# EAGLE design miavita (EAGLE 5.12)
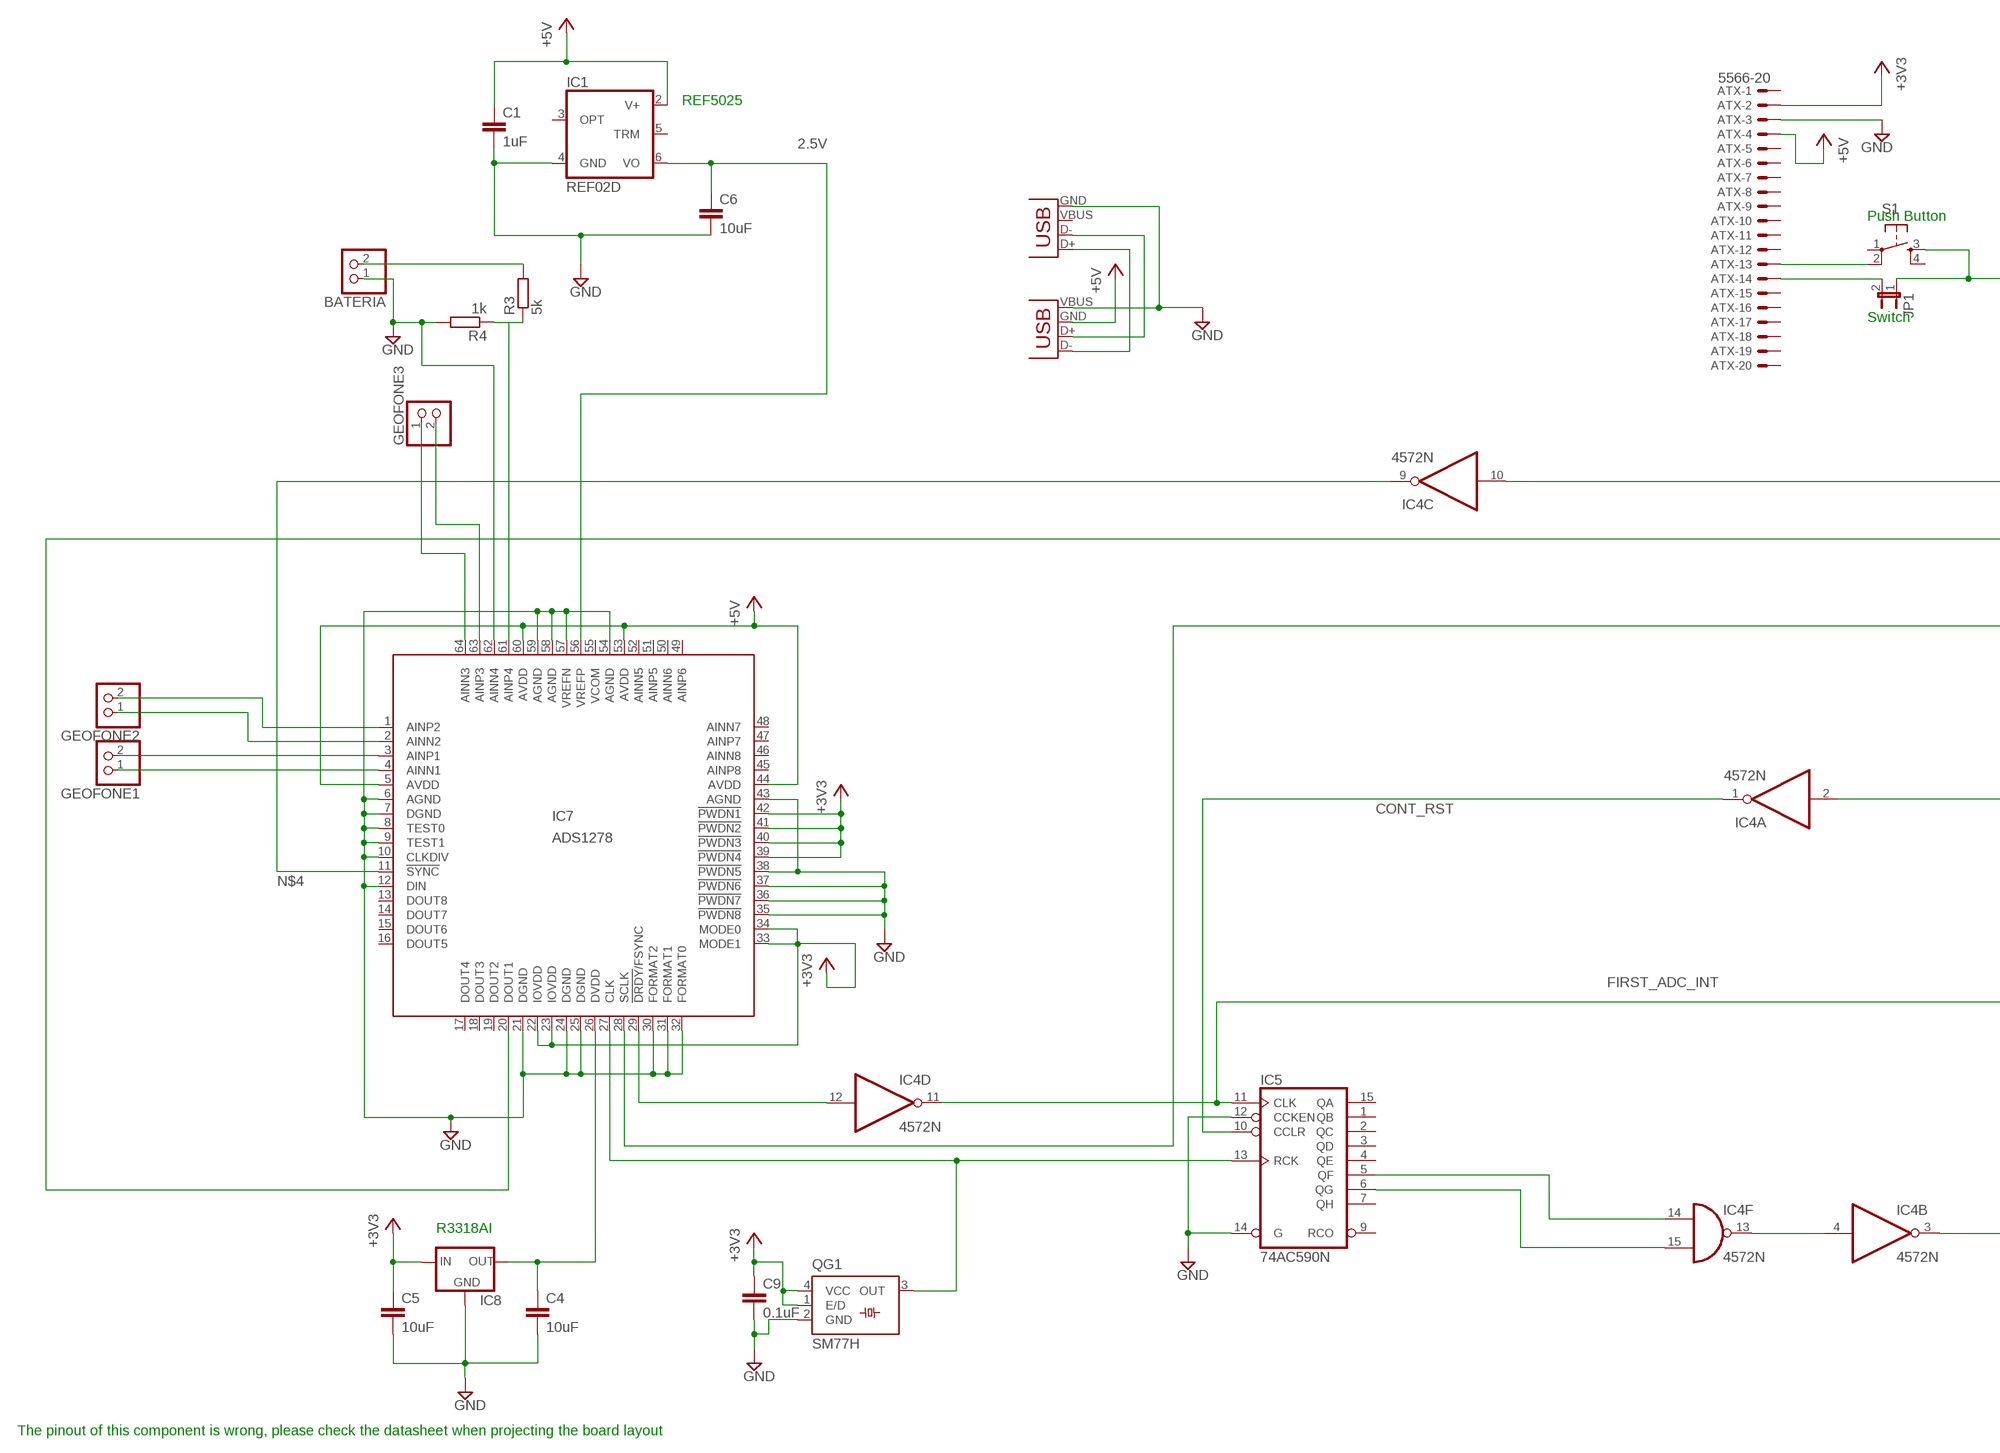
[diagram p0: schematic, sheet 1, part 1 of 2]
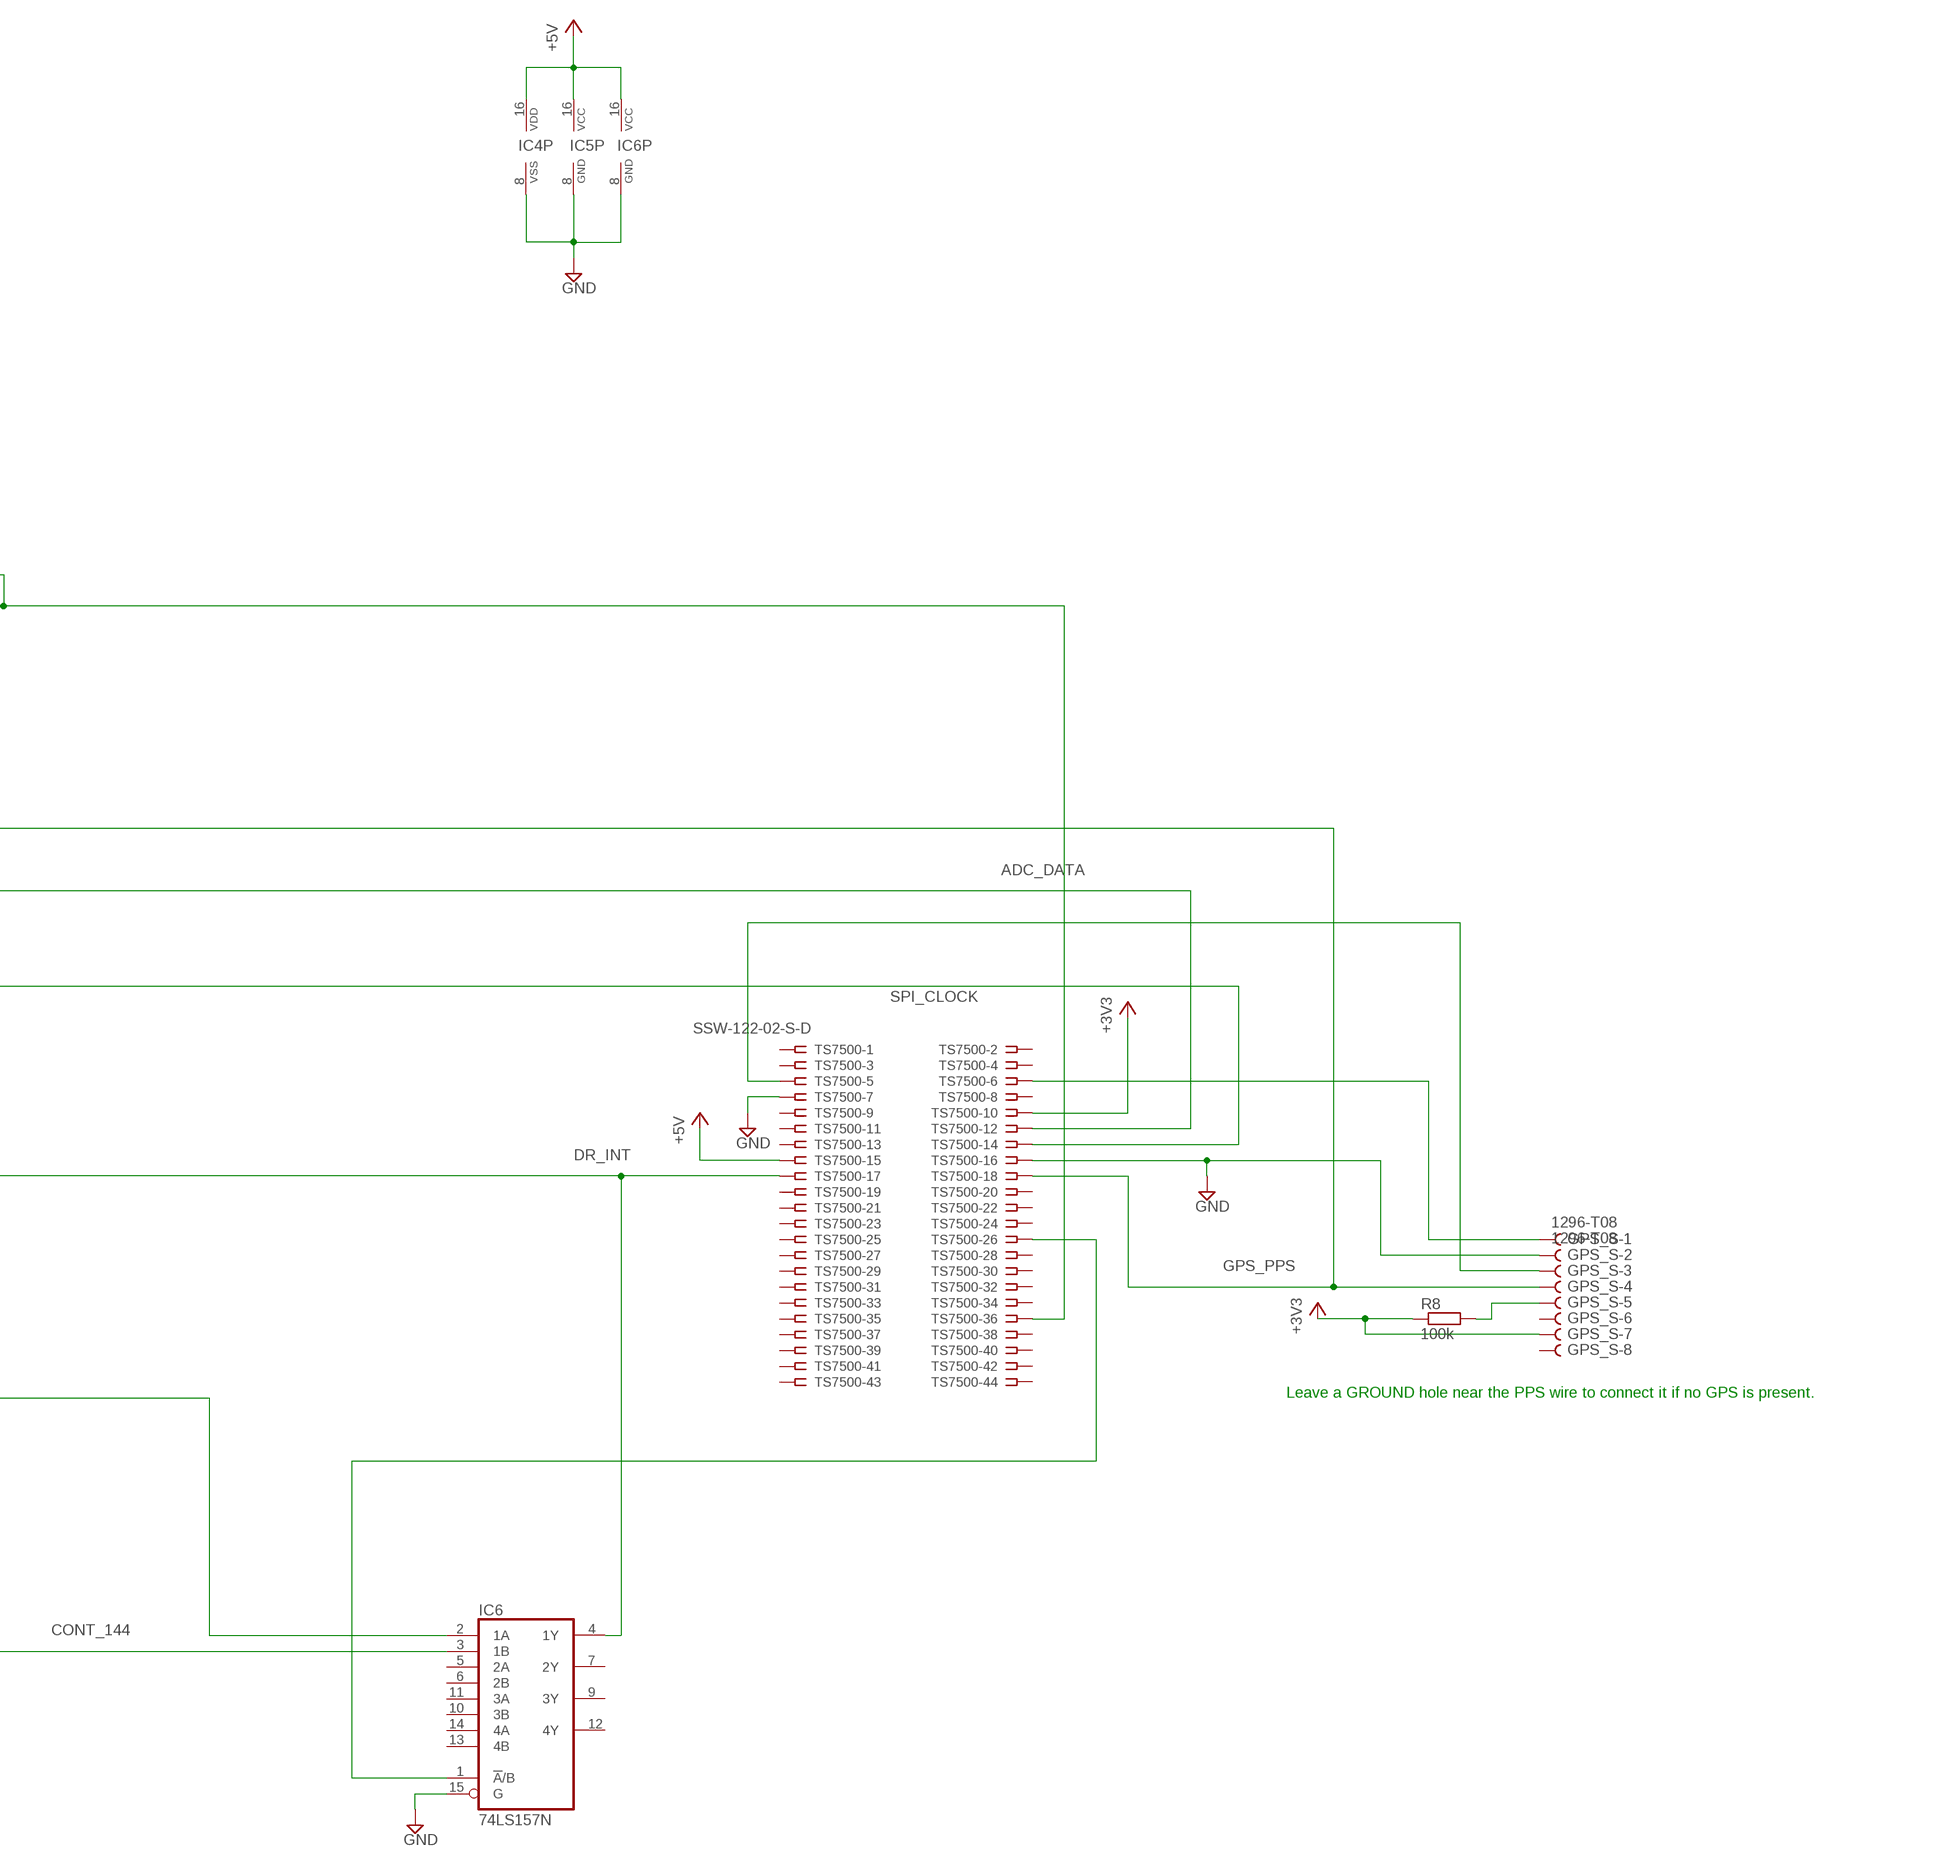
[diagram p1: schematic, sheet 1, part 2 of 2]

## Parts
ATX  5566-20  [5566-20]
BATERIA  PINHD-1X2  [1X02]
C1  1uF  C5/2.5  [C5B2.5]
C4  10uF  C5/2.5  [C5B2.5]
C5  10uF  C5/2.5  [C5B2.5]
C6  10uF  C5/2.5  [C5B2.5]
C9  0.1uF  C5/2.5  [C5B2.5]
GEOFONE1  PINHD-1X2  [1X02]
GEOFONE2  PINHD-1X2  [1X02]
GEOFONE3  PINHD-1X2  [1X02]
GPS_S  1296-T08  [1296-08]
IC1  REF02D  [SO08]
IC4  4572N  [DIL16]
IC5  74AC590N  [DIL16]
IC6  74LS157N  [DIL16]
IC7  ADS1278  [HTQFP-64-PAP]
IC8  XC63FPM  [SOT23]
JP1  JP1E  [JP1]
QG1  SM77H  [SM77H]
R3  5k  R-EU_0204/5  [0204/5]
R4  1k  R-EU_0204/5  [0204/5]
R8  100k  R-EU_0204/5  [0204/5]
S1  TAC_SWITCHPTH  [TACTILE-PTH]
TS7500  SSW-122-02-S-D  [SSW-122-02-S-D]
USBA  USB-A-H  [USB-A-H]
USBB  USBPTH  [USB-B-PTH]

## Nets
2.5V: C6.1 IC1.6(VO) IC7.56(VREFP)
+1V8: C4.1 IC7.26(DVDD) IC8.2(OUT)
+3V3: ATX.2 C5.1 C9.1 GPS_S.7 IC7.22(IOVDD) IC7.23(IOVDD) IC7.33(MODE1) IC7.34(MODE0) IC7.39(!PWDN4) IC7.40(!PWDN3) IC7.41(!PWDN2) IC7.42(!PWDN1) IC8.3(IN) QG1.1(E/D) QG1.4(VCC) R8.1 TS7500.10
+5V: ATX.4 C1.1 IC1.2(V+) IC4.16(P:VDD) IC5.16(VCC) IC6.16(VCC) IC7.5(AVDD) IC7.44(AVDD) IC7.53(AVDD) IC7.60(AVDD) TS7500.15 USBA.GND(VBUS)
ADC_DATA: IC7.20(DOUT1) TS7500.12
CONT_144: IC4.3(B:O) IC6.3(1B)
CONT_RST: IC4.1(A:O) IC5.10(CCLR)
DR_INT: IC4.2(A:I) IC6.4(1Y) TS7500.17
FIRST_ADC_INT: IC4.11(D:O) IC5.11(CLK) IC6.2(1A)
GND: ATX.3 BATERIA.1 C1.2 C4.2 C5.2 C6.2 C9.2 GPS_S.2 IC1.4(GND) IC4.8(P:VSS) IC5.8(GND) IC5.12(CCKEN) IC5.14(G) IC6.8(GND) IC6.15(G) IC7.6(AGND) IC7.7(DGND) IC7.8(TEST0) IC7.9(TEST1) IC7.10(CLKDIV) IC7.12(DIN) IC7.21(DGND) IC7.24(DGND) IC7.25(DGND) IC7.30(FORMAT2) IC7.31(FORMAT1) IC7.32(FORMAT0) IC7.35(!PWDN8) IC7.36(!PWDN7) IC7.37(!PWDN6) IC7.38(!PWDN5) IC7.43(AGND) IC7.54(AGND) IC7.57(VREFN) IC7.58(AGND) IC7.59(AGND) IC7.62(AINN4) IC8.1(GND) QG1.2(GND) R4.2 TS7500.7 TS7500.16 USBA.VBUS(GND) USBB.GND
GPS_PPS: GPS_S.4 IC4.10(C:I) TS7500.18
N$1: IC6.1(!A!/B) TS7500.26
N$2: IC4.15(F:I1) IC5.6(QG)
N$3: IC4.14(F:I0) IC5.5(QF)
N$4: IC4.9(C:O) IC7.11(!SYNC)
N$5: IC4.4(B:I) IC4.13(F:O)
N$6: JP1.1 S1.3 TS7500.36
N$7: IC4.12(D:I) IC7.29(!DRDY!/FSYNC)
N$8: GEOFONE1.2 IC7.3(AINP1)
N$9: ATX.13 S1.2
N$10: GEOFONE1.1 IC7.4(AINN1)
N$11: GEOFONE2.2 IC7.1(AINP2)
N$12: IC7.61(AINP4) R3.1 R4.1
N$13: USBA.D+(D-) USBB.D-
N$14: GEOFONE3.2 IC7.63(AINP3)
N$15: GEOFONE3.1 IC7.64(AINN3)
N$17: IC5.13(RCK) IC7.27(CLK) QG1.3(OUT)
N$18: USBA.D-(D+) USBB.D+
N$19: BATERIA.2 R3.2
N$23: ATX.14 JP1.2
N$42: GPS_S.1 TS7500.6
N$43: GPS_S.3 TS7500.5
N$44: GPS_S.5 R8.2
N$46: GEOFONE2.1 IC7.2(AINN2)
SPI_CLOCK: IC7.28(SCLK) TS7500.14
Unconnected: ATX.1 ATX.5 ATX.6 ATX.7 ATX.8 ATX.9 ATX.10 ATX.11 ATX.12 ATX.15 ATX.16 ATX.17 ATX.18 ATX.19 ATX.20 GPS_S.6 GPS_S.8 IC1.3(OPT) IC1.5(TRM) IC4.5(E:O) IC4.6(E:I0) IC4.7(E:I1) IC5.1(QB) IC5.2(QC) IC5.3(QD) IC5.4(QE) IC5.7(QH) IC5.9(RCO) IC5.15(QA) IC6.5(2A) IC6.6(2B) IC6.7(2Y) IC6.9(3Y) IC6.10(3B) IC6.11(3A) IC6.12(4Y) IC6.13(4B) IC6.14(4A) IC7.13(DOUT8) IC7.14(DOUT7) IC7.15(DOUT6) IC7.16(DOUT5) IC7.17(DOUT4) IC7.18(DOUT3) IC7.19(DOUT2) IC7.45(AINP8) IC7.46(AINN8) IC7.47(AINP7) IC7.48(AINN7) IC7.49(AINP6) IC7.50(AINN6) IC7.51(AINP5) IC7.52(AINN5) IC7.55(VCOM) IC7.EXP1(EXP) IC7.EXP2(EXP) IC7.EXP3(EXP) IC7.EXP4(EXP) IC7.EXP5(EXP) IC7.EXP6(EXP) IC7.EXP7(EXP) IC7.EXP8(EXP) IC7.EXP9(EXP) IC7.EXP10(EXP) IC7.EXP11(EXP) IC7.EXP12(EXP) IC7.EXP13(EXP) IC7.EXP14(EXP) IC7.EXP15(EXP) IC7.EXP16(EXP) IC7.EXP17(EXP) IC7.EXP18(EXP) IC7.EXP19(EXP) IC7.EXP20(EXP) IC7.EXP21(EXP) IC7.EXP22(EXP) IC7.EXP23(EXP) IC7.EXP24(EXP) IC7.EXP25(EXP) S1.1 S1.4 TS7500.1 TS7500.2 TS7500.3 TS7500.4 TS7500.8 TS7500.9 TS7500.11 TS7500.13 TS7500.19 TS7500.20 TS7500.21 TS7500.22 TS7500.23 TS7500.24 TS7500.25 TS7500.27 TS7500.28 TS7500.29 TS7500.30 TS7500.31 TS7500.32 TS7500.33 TS7500.34 TS7500.35 TS7500.37 TS7500.38 TS7500.39 TS7500.40 TS7500.41 TS7500.42 TS7500.43 TS7500.44 USBB.VBUS

## Notes on the sheet
- REF5025
- Push Button
- Switch
- Leave a GROUND hole near the PPS wire to connect it if no GPS is present.
- R3318AI
- The pinout of this component is wrong, please check the datasheet when projecting the board layout

## Library data of the parts
ATX = con-molex:5566-20: Mini FIT connector 20 pol ATX PC-Motherboard Power connector Source: http://www.molex.com; OC_FARNELL: unknown; OC_NEWARK: unknown
BATERIA GEOFONE1-GEOFONE3 = pinhead:PINHD-1X2: PIN HEADER
C1 C4-C6 C9 = capacitor-wima:C: CAPACITOR naming: grid - package width
GPS_S = con-leotronics:1296-T08: 1.27mm SINGLE ROW FEMALE SOCKET Source: http://www.leotronics.co.uk/Conexcon/Data%20Sheets/sec.%20A/1296ing.pdf; OC_FARNELL: unknown; OC_NEWARK: unknown
IC1 = linear:REF02: VOLTAGE REFERENCE
IC4 = 45xx:4572: INVERTER/OR/NOR (MC14572BCP)
IC5 = 74xx-eu:74*590: 8-bit binary COUNTER, output register
IC6 = 74xx-eu:74*157: Quadruple 2-line to 1-line data SELECTOR/MULTIPLEXER
IC7 = texas:ADS1278: Quad/Octal, Simultaneous Sampling, 24-Bit Analog-to-Digital Converters ADS1274 / ADS1278 Auto generated by make-symbol-device-package-bsdl.ulp Rev. 29 Source: http://focus.ti.com/lit/ds/symlink/ads1274.pdf; MPN: ADS1278IPAPT; OC_FARNELL: 1603419; OC_NEWARK: 50M8811
IC8 = v-reg:XC63FP: Positiv Voltage Regulators www.torex.co.jp/english/product/pro02/pdf/0201_xc62fp.pdf
JP1 = jumper:JP1E: JUMPER
QG1 = crystal:SM77H: 3.3V CMOS Clock Oscillator Source: www.pletronics.com .. sm77h%203.3v.pdf; OC_FARNELL: unknown; OC_NEWARK: unknown
R3 R4 = rcl:R-EU_: RESISTOR, European symbol
R8 = resistor:R-EU_: RESISTOR, European symbol
S1 = SparkFun:TAC_SWITCH: Momentary Switch Button commonly used for reset or general input. Spark Fun Electronics SKU : COM-00097
TS7500 = con-samtec:SSW-122-02-S-D: THROUGH-HOLE .025" SQ POST SOCKET Source: Samtec SSW.pdf; MPN: SSW-122-02-S-D; OC_FARNELL: unknown; OC_NEWARK: 11P9673
USBA USBB = SparkFun:USB: USB Connectors USB-B-PTH is fully proven SKU : PRT-00139 USB-miniB is fully proven SKU : PRT-00587 USB-A-PCB is untested. USB-A-H is throughly reviewed, but untested. Spark Fun Electronics SKU : PRT-00437 USB-B-SMT is throughly reviewed, but untested. Needs silkscreen touching up. USB-A-S has not been used/tested USB-MB-H has not been used/tested

## Board
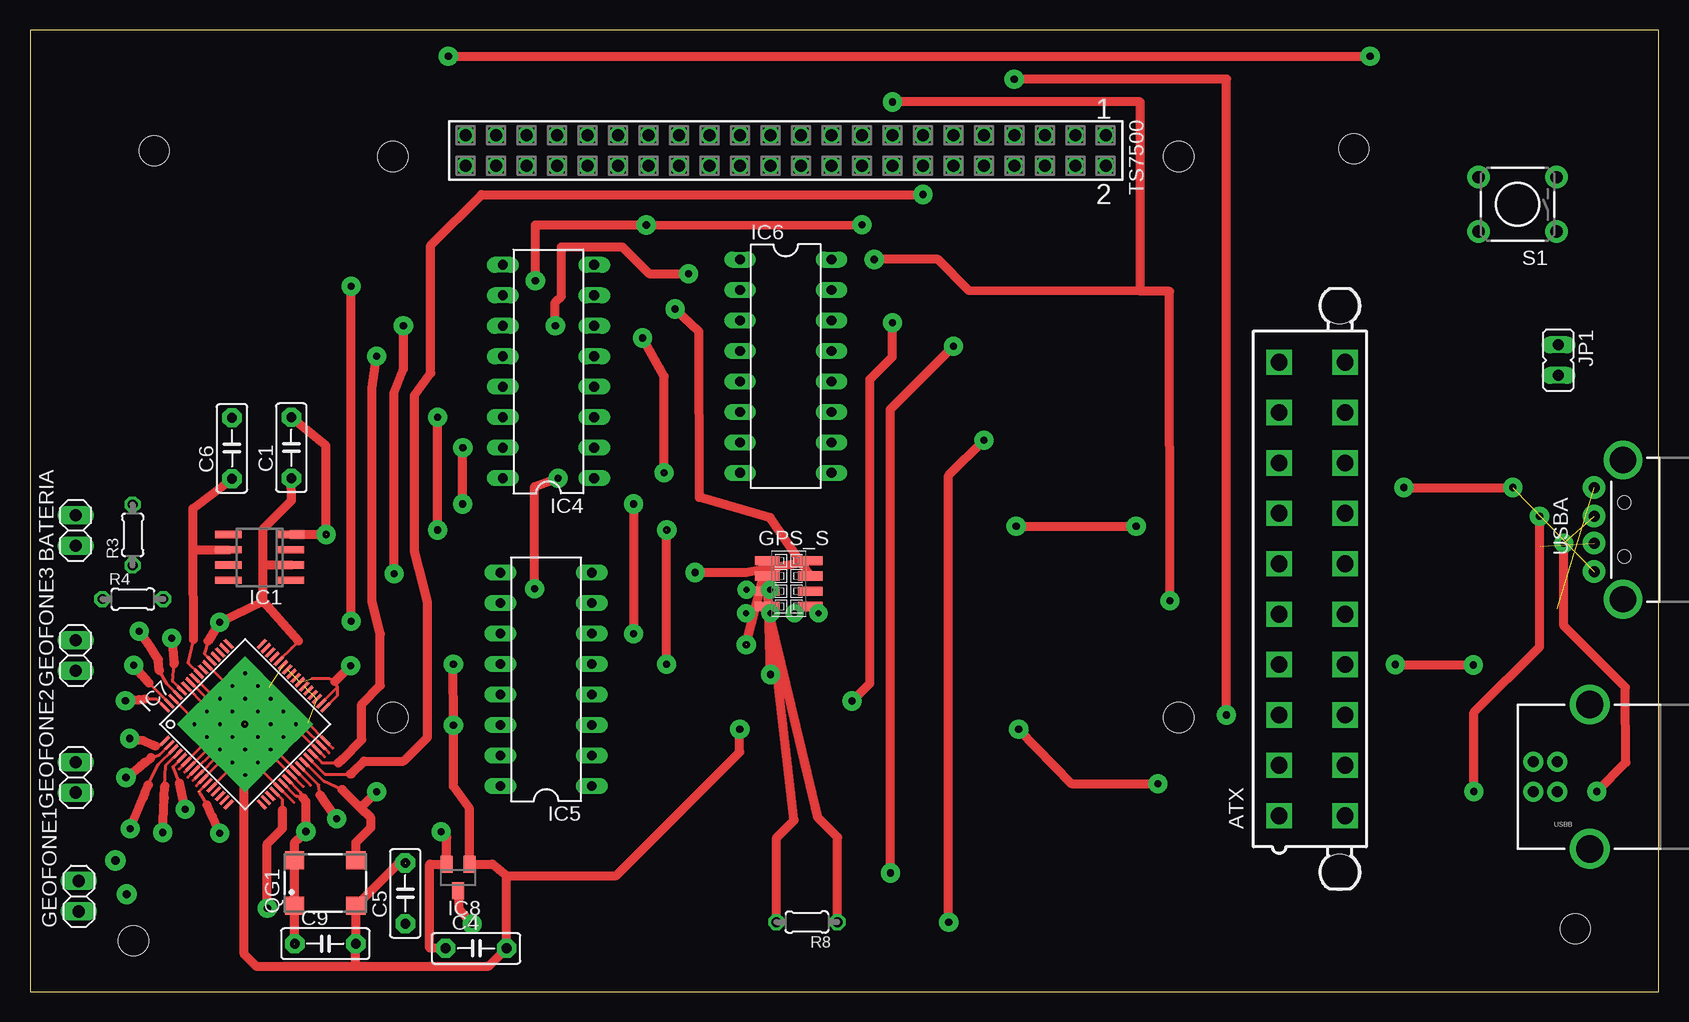
[diagram p2: board, top side]
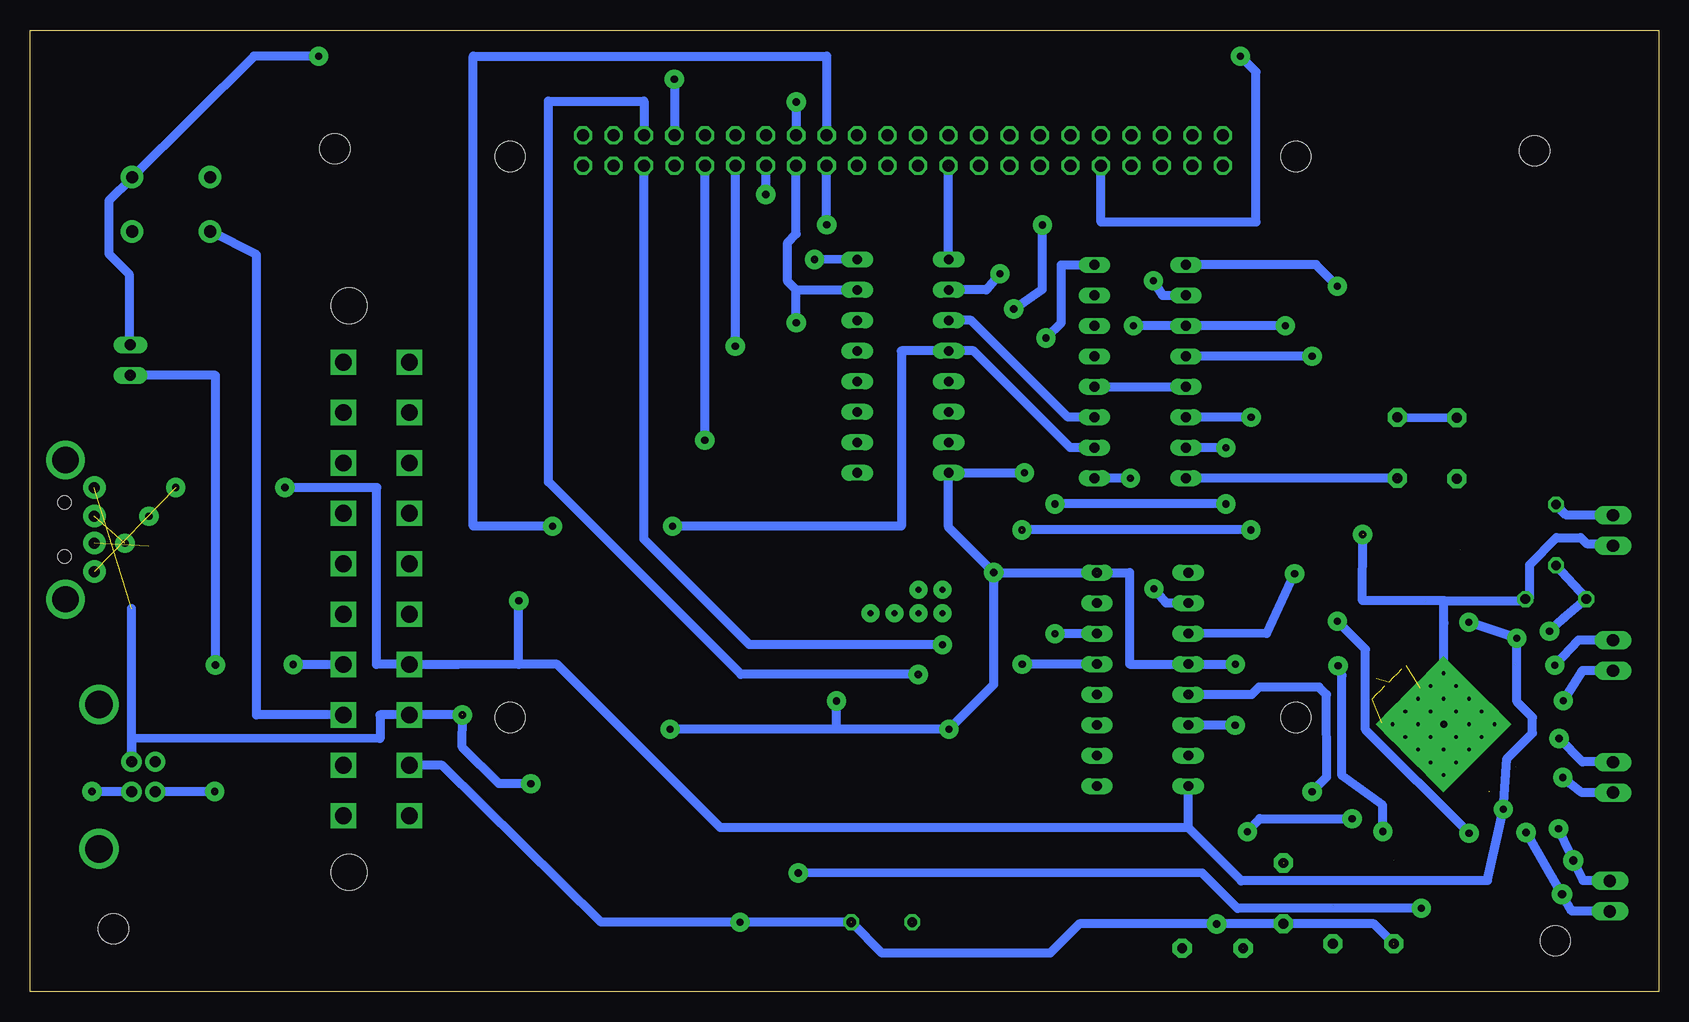
[diagram p3: board, bottom side, seen from below]

Size 135.76 x 80.13 mm. Coordinates in mm from the lower left corner, seen from the top.
Outline: 0,0 135.76,0 135.76,80.13 0,80.13 0,0
Copper layers (1*16): Top 0.035mm / dielectric 1.5mm / Bottom 0.035mm
Design rules "default *": minimum track width 0.75mm, minimum drill 0.5mm, track to track 0.4mm, track to pad 0.4mm, pad to pad 0.4mm, via to via 0.4mm, smd to smd 8mil, copper to edge 40mil, drill to drill 8mil, minimum pad ring 10mil, minimum via ring 0.5mm, stop-mask expansion 0.5mm, vias tented up to drill 0mil, thermal gap 10mil
Holes 2.5 mm at 30.25,69.59 95.75,69.59 95.75,22.84 30.25,22.84 8.62,4.24 128.8,5.24 110.35,70.24 10.35,70.06
tKeepout: area 0,26 to 0,26

### Footprints (pad centres in the part's own frame; a part is rotated, then mirrored left to right if it is on the bottom)
5566-20 = drill 1.4 square: 1 18.9,-2.75; 2 14.7,-2.75; 3 10.5,-2.75; 4 6.3,-2.75; 5 2.1,-2.75; 6 -2.1,-2.75; 7 -6.3,-2.75; 8 -10.5,-2.75; 9 -14.7,-2.75; 10 -18.9,-2.75; 11 18.9,2.75; 12 14.7,2.75; 13 10.5,2.75; 14 6.3,2.75; 15 2.1,2.75; 16 -2.1,2.75; 17 -6.3,2.75; 18 -10.5,2.75; 19 -14.7,2.75; 20 -18.9,2.75 | hole 3: 23.6,2.29; -23.6,2.29
1X02 = drill 1.016 long: 1 -1.27,0; 2 1.27,0
C5B2.5 = drill 0.813 pad 1.6 octagon: 1 -2.54,0; 2 2.54,0
1296-08 = smd 0.76 x 2.05: 1 -1.905,-1.78; 2 -1.905,1.78; 3 -0.635,-1.78; 4 -0.635,1.78; 5 0.635,-1.78; 6 0.635,1.78; 7 1.905,-1.78; 8 1.905,1.78
SO08 = smd 0.6 x 2.2: 1 -1.905,-2.6; 2 -0.635,-2.6; 3 0.635,-2.6; 4 1.905,-2.6; 5 1.905,2.6; 6 0.635,2.6; 7 -0.635,2.6; 8 -1.905,2.6
DIL16 = drill 0.813 long: 1 -8.89,-3.81; 2 -6.35,-3.81; 3 -3.81,-3.81; 4 -1.27,-3.81; 5 1.27,-3.81; 6 3.81,-3.81; 7 6.35,-3.81; 8 8.89,-3.81; 9 8.89,3.81; 10 6.35,3.81; 11 3.81,3.81; 12 1.27,3.81; 13 -1.27,3.81; 14 -3.81,3.81; 15 -6.35,3.81; 16 -8.89,3.81
HTQFP-64-PAP = smd 1 x 0.25: 1 -5.7,3.75; 2 -5.7,3.25; 3 -5.7,2.75; 4 -5.7,2.25; 5 -5.7,1.75; 6 -5.7,1.25; 7 -5.7,0.75; 8 -5.7,0.25; 9 -5.7,-0.25; 10 -5.7,-0.75; 11 -5.7,-1.25; 12 -5.7,-1.75; 13 -5.7,-2.25; 14 -5.7,-2.75; 15 -5.7,-3.25; 16 -5.7,-3.75; 33 5.7,-3.75; 34 5.7,-3.25; 35 5.7,-2.75; 36 5.7,-2.25; 37 5.7,-1.75; 38 5.7,-1.25; 39 5.7,-0.75; 40 5.7,-0.25; 41 5.7,0.25; 42 5.7,0.75; 43 5.7,1.25; 44 5.7,1.75; 45 5.7,2.25; 46 5.7,2.75; 47 5.7,3.25; 48 5.7,3.75 | smd 0.25 x 1: 17 -3.75,-5.7; 18 -3.25,-5.7; 19 -2.75,-5.7; 20 -2.25,-5.7; 21 -1.75,-5.7; 22 -1.25,-5.7; 23 -0.75,-5.7; 24 -0.25,-5.7; 25 0.25,-5.7; 26 0.75,-5.7; 27 1.25,-5.7; 28 1.75,-5.7; 29 2.25,-5.7; 30 2.75,-5.7; 31 3.25,-5.7; 32 3.75,-5.7; 49 3.75,5.7; 50 3.25,5.7; 51 2.75,5.7; 52 2.25,5.7; 53 1.75,5.7; 54 1.25,5.7; 55 0.75,5.7; 56 0.25,5.7; 57 -0.25,5.7; 58 -0.75,5.7; 59 -1.25,5.7; 60 -1.75,5.7; 61 -2.25,5.7; 62 -2.75,5.7; 63 -3.25,5.7; 64 -3.75,5.7 | drill 0.3 pad 2 square: EXP1 -3,3; EXP2 -1.5,3; EXP3 0,3; EXP4 1.5,3; EXP5 3,3; EXP6 -3,1.5; EXP7 -1.5,1.5; EXP8 0,1.5; EXP9 1.5,1.5; EXP10 3,1.5; EXP11 -3,0; EXP12 -1.5,0; EXP13 0,0; EXP14 1.5,0; EXP15 3,0; EXP16 -3,-1.5; EXP17 -1.5,-1.5; EXP18 0,-1.5; EXP19 1.5,-1.5; EXP20 3,-1.5; EXP21 -3,-3; EXP22 -1.5,-3; EXP23 0,-3; EXP24 1.5,-3; EXP25 3,-3
SOT23 = smd 1 x 1.4: 1 -0.95,-1.1; 2 0.95,-1.1; 3 0,1.1
JP1 = drill 0.914 long: 1 0,-1.27; 2 0,1.27
SM77H = smd 1.6 x 1.5: 1 -2.55,-1.9; 2 2.55,-1.9; 3 2.55,1.9; 4 -2.55,1.9
0204/5 = drill 0.813 octagon: 1 -2.54,0; 2 2.54,0
TACTILE-PTH = drill 1.016 pad 1.88 round: 1 -3.251,2.261; 2 3.251,2.261; 3 -3.251,-2.261; 4 3.251,-2.261
SSW-122-02-S-D = drill 1 pad 1.5 octagon: 1 -26.67,-1.27; 2 -26.67,1.27; 3 -24.13,-1.27; 4 -24.13,1.27; 5 -21.59,-1.27; 6 -21.59,1.27; 7 -19.05,-1.27; 8 -19.05,1.27; 9 -16.51,-1.27; 10 -16.51,1.27; 11 -13.97,-1.27; 12 -13.97,1.27; 13 -11.43,-1.27; 14 -11.43,1.27; 15 -8.89,-1.27; 16 -8.89,1.27; 17 -6.35,-1.27; 18 -6.35,1.27; 19 -3.81,-1.27; 20 -3.81,1.27; 21 -1.27,-1.27; 22 -1.27,1.27; 23 1.27,-1.27; 24 1.27,1.27; 25 3.81,-1.27; 26 3.81,1.27; 27 6.35,-1.27; 28 6.35,1.27; 29 8.89,-1.27; 30 8.89,1.27; 31 11.43,-1.27; 32 11.43,1.27; 33 13.97,-1.27; 34 13.97,1.27; 35 16.51,-1.27; 36 16.51,1.27; 37 19.05,-1.27; 38 19.05,1.27; 39 21.59,-1.27; 40 21.59,1.27; 41 24.13,-1.27; 42 24.13,1.27; 43 26.67,-1.27; 44 26.67,1.27
USB-A-H = drill 0.914 pad 1.88 round: D+ 2.4,1.127; D- 2.4,-1.127; GND 2.4,3.5; VBUS 2.4,-3.5 | drill 2.2 round: GND2 0,-5.8; GND3 0,5.8 | hole 1.1: -0.1,2.25; -0.1,-2.25
USB-B-PTH = drill 0.914 pad 1.676 round: D+ 0,1.25; D- 1.981,1.25; GND 0,-1.25; VBUS 1.981,-1.25 | drill 2.286 round: S1 -2.718,-6.02; S2 -2.718,6.02

### Placement (x,y rotation side)
ATX  106.88,33.55 270 top
BATERIA  3.81,38.43 90 top
C1  21.79,45.33 90 top
C4  37.18,3.6 0 top
C5  31.29,8.18 90 top
C6  16.84,45.27 90 top
C9  24.62,4 0 top
GEOFONE1  4.06,7.95 90 top
GEOFONE2  3.81,17.85 90 top
GEOFONE3  3.81,28.01 90 top
GPS_S  63.25,34 270 top
IC1  19.15,36.19 90 top
IC4  43.22,51.67 90 top
IC5  43.02,26.02 90 top
IC6  63,52.12 270 top
IC7  17.94,22.28 45 top
IC8  35.69,9.51 180 top
JP1  127.4,52.63 180 top
QG1  24.62,9.05 0 top
R3  8.56,38.05 90 top
R4  8.57,32.71 0 top
R8  64.77,5.79 180 top
S1  124,65.61 180 top
TS7500  63,70.09 180 top
USBA  132.79,38.5 180 top
USBB  127.3,17.92 180 top

### Tracks (layer width: path | path; a pad name or v marks a point on that pad's centre or on a via)
2.5V  (1 unrouted)
  Top 0.1: IC1.6 16.5,37.09
  Top 0.25: IC7.56 13.2,27.37 13.62,29.34
  Top 0.75: 13.62,29.34 13.6,36.64 | 13.6,36.64 13.6,36.81 IC1.6 | C6.1 13.6,40.26 13.6,36.64
+1V8  (via drill 0.6)  (1 unrouted)
  Top 0.25: IC7.26 24.07,17.21 24.18,16.39
  Top 0.75: 24.18,16.39 24.65,15.69 v25.55,14.41 | 34.64,3.62 33.33,3.62 33.33,10.61 IC8.2 34.74,12.85 v34.27,13.31
  Bottom 0.75: v34.27,13.31 33.25,14.41 v25.55,14.41
+3V3  (via drill 0.5, 0.6)  (8 unrouted)
  Top 0.1: 22.75,16.11 22.5,16.09
  Top 0.25: 22.57,16.59 IC7.23 | 22.57,16.59 22.75,16.11 22.23,16.27 22.16,16.29 IC7.22 | 22.57,16.59 22.73,16.16 | 23.52,26.09 24.93,26.09 25.4,25.84 | 25.4,25.84 25.66,26.09 | IC7.33 25.6,24.64 25.6,25.35 | 25.6,25.35 IC7.34 | 25.4,25.84 25.6,25.35
  Top 0.75: 22.75,16.11 22.77,16.11 23,15.84 v23,13.34 22.07,12.46 QG1.4 QG1.1 22.07,3.96 | IC8.3 35.75,8.37 35.75,6.87 v36.85,5.64 | v26.73,27.16 25.4,25.84 | GPS_S.7 65.71,14.47 67.32,12.86 R8.1 | v79.51,45.94 76.58,43.01 v76.58,5.78
  Bottom 0.75: C9.1 23.73,5.64 C5.1 v36.85,5.64 48.29,5.64 48.3,5.64 50.73,3.21 64.73,3.21 R8.1 v76.58,5.78 88.15,5.78 101.39,18.86 ATX.2 | v23,13.34 23,15.51 26.39,18 26.39,26.33 v26.73,27.16 | v79.51,45.94 v79.51,68.79 TS7500.10
+5V  (via drill 0.6)  (6 unrouted)
  Top 0.25: IC7.60 11.89,25.86 12,27.29 | IC7.44 21.8,28.62 22.38,29.2 | IC7.5 11.93,18.74 | 12.47,17.36 11.93,18.74 | IC7.53 14.53,28.17 14.85,29.21
  Top 0.75: C1.1 21.8,40.94 19.45,38.56 19.45,35.55 | v12.95,15.19 12.47,17.36 | v11.82,29.44 12,27.29 | 14.85,29.21 v15.82,30.79 19.45,32.54 22.38,29.2 | 19.45,35.55 IC1.2 | 19.45,32.54 19.45,35.55 | v70.38,61.01 75.69,61.01 78.29,58.41 92.55,58.37 | v95.02,32.57 94.98,58.36 92.55,58.37 | v71.89,74.14 92.55,74.14 92.55,58.37 | v114.51,42 v123.61,42
  Bottom 0.75: C1.1 IC4.16 | 39.21,13.66 34.79,9.22 14.27,9.24 12.96,15.15 | 12.96,15.15 v12.95,15.19 | 39.21,13.66 39.9,13.66 78.22,13.66 91.82,27.26 95.02,27.26 | 39.21,13.66 39.21,13.65 | 39.21,13.66 IC5.16 | 12.96,15.15 12.65,19.41 10.53,21.53 10.53,22.86 11.82,24.16 v11.82,29.44 v15.82,30.79 | IC6.16 v70.39,61.02 | 95.02,27.26 100.08,27.25 ATX.4 104.15,27.27 106.87,27.27 106.85,42 v114.51,42 | 95.02,27.26 v95.02,32.57 | v71.89,74.14 TS7500.15
ADC_DATA  (via drill 0.6)
  Top 0.25: IC7.20 21.05,15.99 21.05,15.14
  Top 0.75: 21.05,15.14 21.05,13.6 19.79,12.34 v19.79,6.94 | v76.97,53.77 71.72,48.52 v71.72,9.89
  Bottom 0.75: v19.79,6.94 35.11,6.94 38.05,9.88 v71.72,9.89 | v76.97,53.77 TS7500.12
CONT_144
  Bottom 0.75: IC4.3 49.24,47.86 57.31,55.93 IC6.3
CONT_RST  (via drill 0.6)  (2 unrouted)
  Top 0.75: v42.07,33.57 42.07,42.09 v44.02,42.79
  Bottom 0.75: v44.03,42.78 IC4.1 | IC5.10 41.04,32.37 v42.07,33.57
DR_INT  (via drill 0.6)
  Top 0.75: v82.21,38.78 v92.21,38.79
  Bottom 0.75: IC4.2 49.05,45.32 57.12,53.39 IC6.4 63.12,53.39 63.12,38.78 v82.21,38.78 | v92.21,38.79 98.81,38.79 98.81,77.95 69.35,77.95 TS7500.17
FIRST_ADC_INT  (via drill 0.6)
  Top 0.75: v31.13,55.49 31.13,51.9 30.35,49.89 v30.35,34.83 | v43.79,55.48 43.78,57.44 44.3,57.96 44.3,62.06 49.37,62.06 51.61,59.82 v54.9,59.82
  Bottom 0.75: IC5.11 32.68,29.84 v30.35,34.83 | v31.13,55.49 IC4.11 v43.79,55.48 | IC6.2 56.04,58.47 v54.9,59.82
GND  (via drill 0.6)  (17 unrouted)
  Top 0.1: BATERIA.1 3.75,37.09
  Top 0.25: 23.1,22.39 23.13,22.39 IC7.32 25.23,20.29 | 24.93,19.89 IC7.31 22.86,21.95 | IC7.30 24.55,19.57 | 22.86,21.95 22.83,21.99 22.8,21.99 22.8,22.09 23.1,22.39 | IC7.30 22.62,21.49 22.3,21.49 | 20.5,24.49 20.4,24.49 20.2,24.69 20.2,24.9 20.19,24.89 20,24.89 | 19.9,25.3 19.9,25.19 19.7,24.99 | 16.6,25.39 IC7.54 | 16.6,25.39 16.6,25.09 16.2,24.69 15.4,24.69 | IC7.62 13.64,22.69 14.1,22.69 | 14.66,23.79 IC7.59 | 14.66,23.79 15.1,23.79 15.37,24.05 | IC7.58 14.97,24.19 15.4,24.19 | IC7.57 15.18,24.69 15.4,24.69 | 15.19,20.59 15.2,20.6 15.2,20.66 | 15.2,20.66 15.2,20.69 | 15.27,19.96 IC7.8 | 15.27,19.96 15.62,19.66 15.65,19.64 | 15.65,19.64 IC7.9 | 15.65,19.64 15.7,19.69 16.1,19.39 16.11,19.39 | 16.11,19.39 IC7.10 | 15.37,24.05 15.4,24.09 | 14.1,22.69 14.4,22.39 14.4,20.51 IC7.6 14.58,20.69 15.21,20.67 15.13,20.66 15.2,20.66 | 14.66,23.79 14.1,23.23 14.1,22.69 | 15.65,19.64 | 16.11,19.39 17.2,19.39 17.3,19.29 17.3,18.69 | 15.19,20.59 IC7.7 | 15.19,20.59 15.2,20.59 15.18,20.69 15.27,19.96 | 15.4,24.19 15.4,24.69 | 16.6,25.39 17,24.99 | 17,24.99 19.4,24.99 | 19.4,24.99 19.4,25.51 | 19.83,24.89 19.8,24.89 | 20,24.89 20.8,24.09 20.81,24.09 22.51,22.39 23.1,22.39 | IC7.30 22.32,21.79 22.3,21.79 22.46,21.95 22.86,21.95 | IC7.25 23.38,17.19 21.73,18.87 20.81,19.79 20.43,19.79 20.41,19.77 20.4,19.77 20.4,19.47 | IC7.24 22.78,17.09 20.45,19.42 | 20.4,19.47 20.45,19.42 | 20.4,19.47 19.62,18.69 19.3,18.69 | 17.3,18.69 17.87,18.69 19.3,18.69 | 20.45,19.42 20.38,19.42 | 17.92,22.28 17.94,22.28 | 15.4,24.19 15.37,24.16 15.37,24.05 | 19.7,24.99 19.44,24.99 19.43,25 19.39,25 19.4,24.99 | 19.7,24.99 19.81,24.88 19.82,24.88 19.83,24.89
  Top 0.25: 19.83,24.89 20,24.89 | 17,24.99 17.4,24.59 17.4,22.79 v17.9,22.29 | 17.3,18.69 16.82,18.69 IC7.12 | 22,15.75 IC7.21 19.3,18.45 19.3,18.69
  Top 0.75: IC1.4 v24.68,38.09 24.68,45.47 C1.2 | 27.16,2.12 C9.2 27.18,4.01 27.18,7.17 30.73,10.71 C5.2 | 27.16,2.12 18.85,2.12 17.87,3.1 17.87,18.69 | 27.16,2.12 38.23,2.12 C4.2 39.72,9.67 48.87,9.67 59.16,19.96 v59.16,21.87 | 39.73,9.66 38.55,10.61 IC8.1 36.64,15.27 35.3,17.11 v35.3,22.2 v35.29,27.29 | v55.43,34.93 59.71,34.93 GPS_S.2 | v51.07,54.47 52.86,51.26 v52.86,43.23 | v94.01,17.33 86.8,17.33 v82.41,21.87 | v68.53,24.21 70,25.68 70,51.01 71.89,52.9 v71.89,55.73 | v82.05,76.04 99.73,76.04 v99.73,23.06
  Bottom 0.1: 17.9,30.73 18,31.09
  Bottom 0.75: v17.9,22.29 17.9,30.73 17.9,32.59 | BATERIA.1 4,37.34 6,37.34 6.5,37.84 8.53,37.84 10.75,35.56 10.75,32.84 R4.2 11.25,32.59 17.9,32.59 | 17.9,32.59 24.7,32.59 v24.68,38.09 | C1.2 C6.2 | v35.3,22.2 IC5.14 | v35.28,27.29 IC5.12 44.1,27.29 44.1,34.91 IC5.8 v55.43,34.92 | 71.89,58.47 IC6.15 | IC4.8 49.79,60.56 49.79,55.75 v51.07,54.47 | v52.86,43.23 IC6.8 59.19,38.68 v55.43,34.92 | 71.89,58.47 72.61,59.19 72.61,62.42 71.89,63.14 TS7500.16 | v99.72,23.05 ATX.3 106.58,23.05 106.58,21.09 127.3,21.11 USBB.GND | v55.43,34.92 55.43,25.6 v59.16,21.87 68.53,21.87 | v55.43,34.92 v55.43,34.93 | 68.53,21.87 v82.41,21.87 | v71.89,55.73 71.89,58.47 | 68.53,21.87 v68.53,24.21 | v82.05,76.04 TS7500.7 | USBB.GND 127.3,31.91 | v94.01,17.33 96.68,17.33 99.73,20.38 v99.72,23.05
GPS_PPS  (via drill 0.5, 0.6)
  Top 0.75: v42.12,59.24 42.11,63.88 v51.37,63.88 v69.35,63.9 | GPS_S.4 61.71,39.49 55.8,41.19 55.77,55 v53.76,56.88
  Bottom 0.75: IC4.10 41.36,58.02 v42.12,59.24 | v69.35,63.9 v69.35,68.81 TS7500.18 | v51.37,63.88 51.37,58.52 v53.76,56.88
N$1  (1 unrouted)
  Bottom 0.75: IC6.1 TS7500.26
N$2  (via drill 0.6)  (4 unrouted)
  Top 0.75: v36.07,40.64 v36.07,45.34 | v50.32,40.64 v50.32,29.82
  Bottom 0.75: v36.08,45.32 IC4.15 | v36.07,40.64 v50.32,40.64 | IC5.6 v50.32,29.83
N$3  (via drill 0.6)  (4 unrouted)
  Top 0.75: v33.99,38.47 v33.99,47.86 | v53.06,27.29 53.06,38.46
  Bottom 0.75: v33.98,47.86 IC4.14 | v33.99,38.47 v53.08,38.47 | IC5.5 v53.06,27.29
N$4  (via drill 0.6)  (2 unrouted)
  Top 0.25: IC7.11 14.1,16.68 | 14.75,15.56 14.1,16.66
  Top 0.75: 14.75,15.56 15.2,14.59 v15.79,13.2 | v26.78,30.85 v26.78,58.79
  Bottom 0.75: IC4.9 32.54,60.57 28.56,60.57 v26.78,58.79 | v15.8,13.2 24.44,21.84 24.44,28.51 v26.78,30.85
N$5
  Bottom 0.75: 39.44,50.38 46.94,50.38
  Bottom 1: 46.94,50.38 IC4.4 | IC4.13 39.44,50.38
N$6  (via drill 0.5, 0.6)
  Top 0.75: v34.87,77.95 v111.7,77.95
  Bottom 0.75: JP1.1 127.5,53.99 127.5,59.79 129.2,61.49 129.2,65.89 127.3,67.79 S1.3 117.09,77.95 v111.7,77.95 | v34.87,77.95 33.57,76.65 33.57,64.13 46.49,64.13 v46.49,68.78 TS7500.36
N$7  (via drill 0.6)
  Top 0.1: 25.5,19.07 25.5,19.09
  Top 0.25: IC7.29 24.34,19.07 25.5,19.07 25.73,19.07
  Top 0.75: 25.73,19.07 25.73,19.09 26,19.34 27.65,20.99 27.65,23.96 29.2,25.52 29.2,29.8 28.52,32.53 28.52,50.3 v28.89,52.96
  Bottom 0.75: v28.89,52.96 IC4.12
N$8  (via drill 0.6)
  Top 0.25: IC7.3 10.7,18.94 9.86,17.23
  Top 0.75: 9.86,17.23 9.85,17.21 9.57,16.52 9.45,16.19 v8.35,13.56
  Bottom 0.75: GEOFONE1.2 4.1,9.24 6.3,9.24 v8.35,13.56
N$9
  Bottom 0.75: ATX.13 116.87,23.05 116.87,61.4 S1.2
N$10  (via drill 0.6)
  Top 0.25: IC7.4 11.33,18.84 11.23,17.14
  Top 0.75: 11.23,17.14 11.2,16.14 v11.05,13.27
  Bottom 0.75: GEOFONE1.1 4.1,6.69 7.22,6.71 10.62,12.59 v11.05,13.27
N$11  (via drill 0.6)
  Top 0.25: IC7.1 10.61,20.26 10.47,20.46
  Top 0.75: 10.47,20.46 10.25,20.54 9.4,20.94 v8.3,21.09
  Bottom 0.75: GEOFONE2.2 3.85,19.14 6.35,19.14 6.55,19.34 8.1,20.94 8.45,21.09 v8.3,21.09
N$12  (via drill 0.6)
  Top 0.25: IC7.61 11.44,25.6 10.79,26.75
  Top 0.75: 10.79,26.75 10.78,26.77 10.7,27.66 10,28.74 v9.1,30.04
  Bottom 0.75: 6.05,32.79 6.01,32.75 | 6.05,32.79 R3.1 | 6.05,32.79 6,32.84 R4.1 6.35,32.44 7.9,31.14 v9.1,30.04
N$13  (via drill 0.6)  (2 unrouted)
  Top 0.75: v120.36,16.67 120.36,23.26 125.85,28.75 125.85,37.13 v125.84,39.62
  Bottom 0.75: v120.36,16.67 USBB.D-
N$14  (via drill 0.6)
  Top 0.25: 9.9,25.73 IC7.63
  Top 0.75: 9.9,25.73 9.25,26.44 v8.65,27.19
  Bottom 0.75: v8.65,27.19 6.7,29.29 3.9,29.29 GEOFONE3.2
N$15  (via drill 0.6)
  Top 0.25: IC7.64 10.53,24.39 9.6,24.39
  Top 0.75: 9.6,24.39 9.1,24.34 8.65,24.29 v7.95,24.24
  Bottom 0.75: v7.95,24.24 6.35,26.74 3.85,26.74 GEOFONE3.1
N$16  (via drill 0.5)
  other vias: 59.19,68.81
N$17  (via drill 0.6)  (1 unrouted)
  Top 0.25: IC7.27 24.5,17.52 26,16.84
  Top 0.75: 26,16.84 26.02,16.84 27.53,15.34 | QG1.3 27.17,12.44 28.43,13.69 28.43,14.44 27.53,15.34 | v28.89,16.66 27.57,15.34 27.53,15.34
  Bottom 0.75: v28.89,16.66 27.66,17.89 27.69,24.75 28.32,25.38 33.32,25.38 33.95,24.75 IC5.13
N$18  (via drill 0.6)  (2 unrouted)
  Top 0.75: v130.6,16.67 133.03,19.1 132.99,25.35 127.86,30.48 v127.85,37.37
  Bottom 0.75: USBB.D+ v130.6,16.67
N$19
  Bottom 0.75: BATERIA.2 7.69,39.7 8.55,40.56 8.75,40.59 R3.2
N$20  (via drill 0.5)
  other vias: 69.34,71.36
N$21  (via drill 0.5)
  other vias: 71.92,68.77
N$22  (via drill 0.5)
  other vias: 71.9,71.35
N$23  (via drill 0.6)  (2 unrouted)
  Top 0.75: v113.82,27.25 v120.3,27.22
  Bottom 0.75: ATX.14 v113.82,27.25 | v120.3,27.22 120.3,51.35 JP1.2
N$24  (via drill 0.5)
  other vias: 74.45,68.8
N$25  (via drill 0.5)
  other vias: 76.96,68.82
N$26  (via drill 0.5)
  other vias: 82.07,71.34
N$27  (via drill 0.5)
  other vias: 84.62,71.35
N$28  (via drill 0.5)
  other vias: 84.61,68.79
N$29  (via drill 0.5)
  other vias: 104.14,27.25
N$30  (via drill 0.5)
  other vias: 104.14,23.03
N$31  (via drill 0.5)
  other vias: 104.14,18.84
N$32  (via drill 0.5)
  other vias: 109.62,23.03
N$33  (via drill 0.5)
  other vias: 109.64,27.24
N$34  (via drill 0.5)
  other vias: 59.71,33.49
N$35  (via drill 0.5)
  other vias: 61.7,33.5
N$36  (via drill 0.5)
  other vias: 59.69,31.52
N$37  (via drill 0.5)
  other vias: 61.71,31.51
N$38  (via drill 0.5)
  other vias: 63.71,31.51
N$39  (via drill 0.5)
  other vias: 65.71,31.53
N$40  (via drill 0.7)
  other vias: 7.12,10.92
N$41  (via drill 0.7)
  other vias: 8.06,8.11
N$42  (via drill 0.6)  (1 unrouted)
  Top 0.75: v59.71,28.91 GPS_S.1
  Bottom 0.75: v59.71,28.91 75.79,28.91 84.59,37.71 TS7500.6
N$43  (via drill 0.6)  (1 unrouted)
  Top 0.75: v61.73,26.43 GPS_S.3
  Bottom 0.75: TS7500.5 84.59,74.2 92.55,74.2 92.55,42.47 76.51,26.43 v61.73,26.43
N$44  (1 unrouted)
  Top 0.75: GPS_S.5 63.71,14.3 62.23,12.82 R8.2
N$46  (via drill 0.6)
  Top 0.25: IC7.2 10.8,19.74 10.1,19.49
  Top 0.75: 10.1,19.49 9.55,19.09 9.25,18.84 v8,17.84
  Bottom 0.75: v8,17.84 6.4,16.59 3.85,16.59 GEOFONE2.1
S$1
  Top 0.25: 12.42,18.54 12.9,19.01
S$2
  Top 0.25: 12.89,18.29 13.27,18.67
S$3
  Top 0.25: 14.25,17.53 13.87,17.15
S$4
  Top 0.25: 13.9,17.89 13.58,17.57
S$5
  Top 0.25: 13.15,17.85 13.51,18.21
SPI_CLOCK  (via drill 0.6)
  Top 0.25: IC7.28 24.58,18.11 26.73,18.11
  Top 0.75: 26.73,18.11 26.75,18.14 26.77,18.14 27.85,19.21 31.12,19.21 33.12,21.21 33.13,32.51 32.06,36.68 32.06,49.68 33.4,51.54 33.4,62.18 37.64,66.42 v74.43,66.42
  Bottom 0.75: v74.43,66.42 TS7500.14